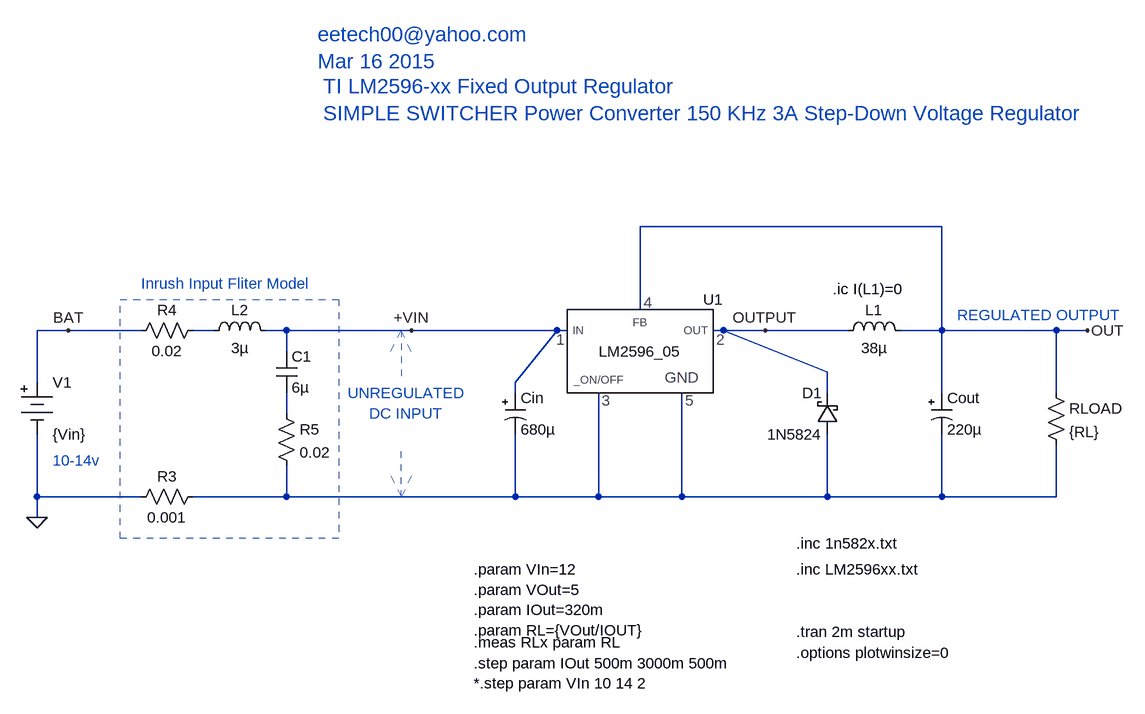
[diagram p0: schematic LM2596_05_In12V_Out5V3A.asc]
LM2596_05_In12V_Out5V3A.asc, the LTspice schematic file:
Version 4
SHEET 1 2324 1244
WIRE 192 -432 -272 -432
WIRE -272 -304 -272 -432
WIRE -1152 -272 -1200 -272
WIRE -1040 -272 -1152 -272
WIRE -928 -272 -960 -272
WIRE -816 -272 -848 -272
WIRE -624 -272 -816 -272
WIRE -400 -272 -624 -272
WIRE -384 -272 -400 -272
WIRE -144 -272 -160 -272
WIRE -80 -272 -144 -272
WIRE 48 -272 -80 -272
WIRE 192 -272 192 -432
WIRE 192 -272 128 -272
WIRE 368 -272 192 -272
WIRE 416 -272 368 -272
WIRE -816 -240 -816 -272
WIRE 16 -208 -144 -272
WIRE -1200 -192 -1200 -272
WIRE -464 -192 -400 -272
WIRE -464 -176 -464 -192
WIRE 16 -176 16 -208
WIRE 192 -176 192 -272
WIRE 368 -176 368 -272
WIRE -816 -144 -816 -176
WIRE -1200 -16 -1200 -112
WIRE -1040 -16 -1200 -16
WIRE -816 -16 -816 -64
WIRE -816 -16 -960 -16
WIRE -464 -16 -464 -112
WIRE -464 -16 -816 -16
WIRE -336 -16 -336 -176
WIRE -336 -16 -464 -16
WIRE -208 -16 -208 -176
WIRE -208 -16 -336 -16
WIRE 16 -16 16 -112
WIRE 16 -16 -208 -16
WIRE 192 -16 192 -112
WIRE 192 -16 16 -16
WIRE 368 -16 368 -96
WIRE 368 -16 192 -16
WIRE -1200 16 -1200 -16
WIRE -1184 16 -1200 16
FLAG -1200 16 0
FLAG -80 -272 OUTPUT
FLAG -624 -272 +VIN
FLAG 416 -272 OUT
FLAG -1152 -272 BAT
SYMBOL ind 32 -256 R270
WINDOW 0 32 56 VTop 2
WINDOW 3 5 56 VBottom 2
SYMATTR InstName L1
SYMATTR Value 38µ
SYMATTR SpiceLine Ipk=3 Rser=50m Cpar=0
SYMBOL res 352 -192 R0
SYMATTR InstName RLOAD
SYMATTR Value {RL}
SYMBOL schottky 32 -112 R180
WINDOW 0 24 64 Left 2
WINDOW 3 24 0 Left 2
SYMATTR InstName D1
SYMATTR Value 1N5824
SYMBOL Misc\\battery -1200 -208 R0
WINDOW 123 0 0 Left 2
SYMATTR InstName V1
SYMATTR Value {Vin}
SYMATTR SpiceLine Rser=0.100
SYMBOL res -944 -32 R90
WINDOW 0 0 56 VBottom 2
WINDOW 3 32 56 VTop 2
SYMATTR InstName R3
SYMATTR Value 0.001
SYMBOL res -944 -288 R90
WINDOW 0 0 56 VBottom 2
WINDOW 3 32 56 VTop 2
SYMATTR InstName R4
SYMATTR Value 0.02
SYMBOL ind -944 -256 R270
WINDOW 0 32 56 VTop 2
WINDOW 3 5 56 VBottom 2
SYMATTR InstName L2
SYMATTR Value 3µ
SYMBOL cap -832 -240 R0
SYMATTR InstName C1
SYMATTR Value 6µ
SYMBOL res -832 -160 R0
SYMATTR InstName R5
SYMATTR Value 0.02
SYMBOL LM2596xx -272 -240 R0
SYMATTR InstName U1
SYMATTR Value LM2596_05
SYMBOL polcap 176 -176 R0
SYMATTR InstName Cout
SYMATTR Value 220µ
SYMATTR SpiceLine V=16 Irms=460m Rser=0.16 Lser=0 mfg="Nichicon" pn="UPL1C221MPH" type="Al electrolytic"
SYMBOL polcap -480 -176 R0
SYMATTR InstName Cin
SYMATTR Value 680µ
SYMATTR SpiceLine V=25 Irms=1.27 Rser=0.055 Lser=0 mfg="Nichicon" pn="UPL1E681MRH6" type="Al electrolytic"
TEXT -32 192 Left 2 !.tran 2m startup
TEXT -528 240 Left 2 !.step param IOut 500m 3000m 500m\n*.step param VIn 10 14 2
TEXT 24 -336 Left 2 !.ic I(L1)=0
TEXT -32 96 Left 2 !.inc LM2596xx.txt
TEXT -32 224 Left 2 !.options plotwinsize=0
TEXT -528 96 Left 2 !.param VIn=12\n.param VOut=5\n.param IOut=320m\n.param RL={VOut/IOUT}
TEXT -1176 -72 Left 2 ;10-14v
TEXT -1040 -344 Left 2 ;Inrush Input Fliter Model
TEXT -528 208 Left 2 !.meas RLx param RL
TEXT -32 56 Left 2 !.inc 1n582x.txt
TEXT -760 -648 Left 3 ;TI LM2596-xx Fixed Output Regulator\nSIMPLE SWITCHER Power Converter 150 KHz 3A Step-Down Voltage Regulator
TEXT -632 -160 Center 2 ;UNREGULATED\nDC INPUT
TEXT 216 -296 Left 2 ;REGULATED OUTPUT
TEXT -768 -728 Left 3 ;eetech00@yahoo.com\nMar 16 2015
LINE Normal -640 -272 -640 -192 2
LINE Normal -624 -240 -640 -272 2
LINE Normal -656 -240 -640 -272 2
LINE Normal -640 -16 -640 -96 2
LINE Normal -656 -48 -640 -16 2
LINE Normal -624 -48 -640 -16 2
RECTANGLE Normal -736 48 -1072 -320 2

The netlist it stands for:
* LM2596_05_In12V_Out5V3A.asc
L1 OUTPUT OUT 38µ Ipk=3 Rser=50m Cpar=0
RLOAD OUT N003 {RL}
D1 N003 OUTPUT 1N5824
V1 BAT 0 {Vin} Rser=0.100
R3 N003 0 0.001
R4 N001 BAT 0.02
L2 N001 +VIN 3µ
C1 +VIN N002 6µ
R5 N002 N003 0.02
XU1 N003 OUT +VIN OUTPUT N003 LM2596_05  ; pins _ON/OFF FB IN OUT VGND
Cout OUT N003 220µ V=16 Irms=460m Rser=0.16 Lser=0 mfg="Nichicon" pn="UPL1C221MPH" type="Al electrolytic"
Cin +VIN N003 680µ V=25 Irms=1.27 Rser=0.055 Lser=0 mfg="Nichicon" pn="UPL1E681MRH6" type="Al electrolytic"
.model D D
.lib standard.dio
.tran 2m startup
.step param IOut 500m 3000m 500m
*.step param VIn 10 14 2
.ic I(L1)=0
.inc LM2596xx.txt
.options plotwinsize=0
.param VIn=12
.param VOut=5
.param IOut=320m
.param RL={VOut/IOUT}
* 10-14v
* Inrush Input Fliter Model
.meas RLx param RL
.inc 1n582x.txt
* TI LM2596-xx Fixed Output Regulator
* SIMPLE SWITCHER Power Converter 150 KHz 3A Step-Down Voltage Regulator
* UNREGULATED
* DC INPUT
* REGULATED OUTPUT
* eetech00@yahoo.com
* Mar 16 2015
.backanno
.end